# EAGLE design dcmctrl-hb-2-board_v1 (EAGLE 6.2)
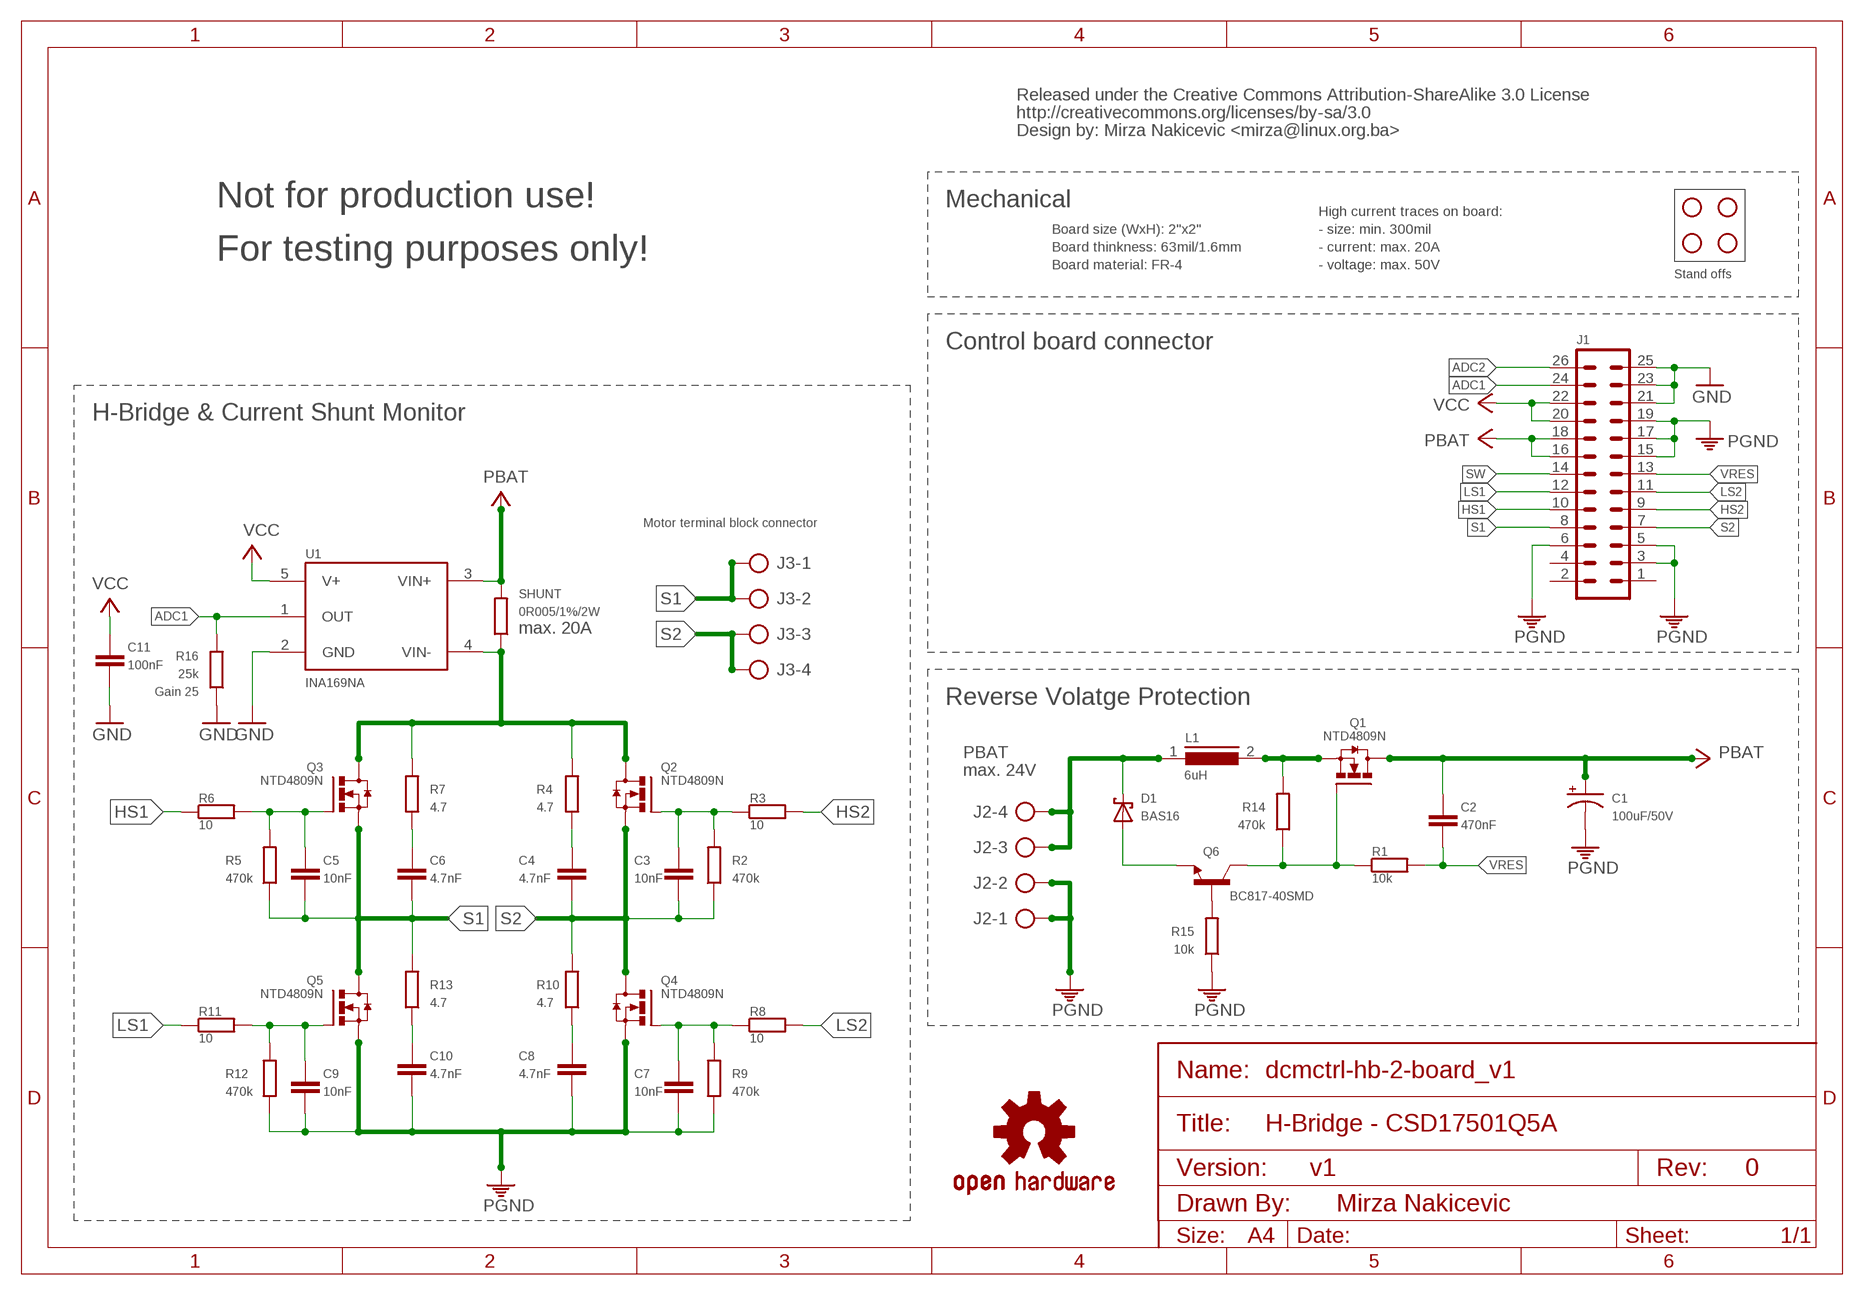
[diagram p0: schematic, sheet 1]

## Parts
C1  100uF/50V  CPOL-USE5-13  [E5-13]
C2  470nF  C-0603  [C0603]
C3  10nF  C-0603  [C0603]
C4  4.7nF  C-0603  [C0603]
C5  10nF  C-0603  [C0603]
C6  4.7nF  C-0603  [C0603]
C7  10nF  C-0603  [C0603]
C8  4.7nF  C-0603  [C0603]
C9  10nF  C-0603  [C0603]
C10  4.7nF  C-0603  [C0603]
C11  100nF  C-0603  [C0603]
D1  BAS16  BAS40  [SOT23]
J1  MA13-2  [MA13-2]
J2  W237-4  [W237-4]
J3  W237-4  [W237-4]
L1  6uH  DR127  [DR127]
Q1  NTD4809N  [DPAK]
Q2  NTD4809N  [DPAK]
Q3  NTD4809N  [DPAK]
Q4  NTD4809N  [DPAK]
Q5  NTD4809N  [DPAK]
Q6  BC817-40SMD  [SOT23-BEC]
R1  10k  R-0603  [R0603]
R2  470k  R-0603  [R0603]
R3  10  R-0603  [R0603]
R4  4.7  R-0603  [R0603]
R5  470k  R-0603  [R0603]
R6  10  R-0603  [R0603]
R7  4.7  R-0603  [R0603]
R8  10  R-0603  [R0603]
R9  470k  R-0603  [R0603]
R10  4.7  R-0603  [R0603]
R11  10  R-0603  [R0603]
R12  470k  R-0603  [R0603]
R13  4.7  R-0603  [R0603]
R14  470k  R-0603  [R0603]
R15  10k  R-0603  [R0603]
R16  25k  R-0603  [R0603]
SHUNT  0R005/1%/2W  R-2512  [R2512]
U1  INA169NA  [SOT23-5]
U$2  STAND-OFF  [STAND-OFF]
U$3  STAND-OFF  [STAND-OFF]
U$4  STAND-OFF  [STAND-OFF]
U$6  STAND-OFF  [STAND-OFF]
U$9  CC-SA  [CC-SA]
U$10  OSHW-LOGOM  [OSHW-LOGO-M]

## Nets
ADC1: J1.24 R16.2 U1.1(OUT)
ADC2: J1.26
GND: C11.2 J1.21 J1.23 J1.25 R16.1 U1.2(GND)
HS1: J1.10 R6.1
HS2: J1.9 R3.2
LS1: J1.12 R11.1
LS2: J1.11 R8.2
N$1: C5.1 Q3.1(G) R5.2 R6.2
N$2: Q6.B R15.2
N$3: C9.1 Q5.1(G) R11.2 R12.2
N$4: C7.1 Q4.1(G) R8.1 R9.2
N$5: C3.1 Q2.1(G) R2.2 R3.1
N$6: C6.1 R7.1
N$7: D1.1(A) Q6.E
N$8: C10.1 R13.1
N$9: Q1.1(G) Q6.C R1.1 R14.1
N$10: C8.1 R10.1
N$11: C4.1 R4.1
PBAT: C1.+ C2.1 J1.16 J1.18 Q1.4(D) SHUNT.2 U1.3(VIN+)
PBAT-: Q2.4(D) Q3.4(D) R4.2 R7.2 SHUNT.1 U1.4(VIN-)
PGND: C1.- C7.2 C8.2 C9.2 C10.2 J1.3 J1.5 J1.6 J1.15 J1.17 J1.19 J2.1 J2.2 Q4.3(S) Q5.3(S) R9.1 R12.1 R15.1
S1: C5.2 C6.2 J1.8 J3.1 J3.2 Q3.3(S) Q5.4(D) R5.1 R13.2
S2: C3.2 C4.2 J1.7 J3.3 J3.4 Q2.3(S) Q4.4(D) R2.1 R10.2
SW: J1.14
VCC: C11.1 J1.20 J1.22 U1.5(V+)
VIN: D1.3(C) J2.3 J2.4 L1.1
VIN2: L1.2 Q1.3(S) R14.2
VRES: C2.2 J1.13 R1.2
Unconnected: J1.1 J1.2 J1.4

## Notes on the sheet
- Not for production use! | Mechanical
- High current traces on board:
- Board size (WxH): 2"x2" | - size: min. 300mil
- Board thinkness: 63mil/1.6mm | - current: max. 20A
- For testing purposes only!
- Board material: FR-4 | - voltage: max. 50V
- Stand offs
- Control board connector
- H-Bridge & Current Shunt Monitor
- Motor terminal block connector
- max. 20A
- Gain 25
- Reverse Volatge Protection
- PBAT
- max. 24V
- H-Bridge - CSD17501Q5A
- v1 | 0
- Mirza Nakicevic
- A4

## Library data of the parts
C1 = rcl:CPOL-US: POLARIZED CAPACITOR, American symbol
C2-C11 = rlc:C: Capacitor Standard SMD ceramic and 0.1" leaded capacitors.
D1 = diode:BAS40: Silicon Schottky Diodes General-purpose diode for high-speed switching
J1 = con-pinhead:MA13-2: PIN HEADER; OC_FARNELL: unknown; OC_NEWARK: unknown
J2 J3 = con-wago-500:W237-4: WAGO SCREW CLAMP; OC_FARNELL: unknown; OC_NEWARK: unknown
L1 = inductors:DR127: High Power Density, High Efficiency, Shielded Inductors Source: coiltronics_dr_series.pdf
Q1-Q5 = transistor-fet:NTD4809N
Q6 = transistor-npn:BC817*: NPN Transistor
R1-R16 SHUNT = rlc:R: Resistor Basic schematic elements and footprints for 0603, 1206, and PTH 1/10th watt (small) resistors.
U1 = ic-opamp:INA169: High-Side Measurement CURRENT SHUNT MONITOR
U$2-U$4 U$6 = other:STAND-OFF: Stand Off This is the mechanical footprint for a #4 phillips button head screw. Use the keepout ring to avoid running the screw head into surrounding components.
U$9 = other:CC-SA
U$10 = other:OSHW-LOGO: Open Source Hardware Logo This logo indicates the piece of hardware it is found on incorporates a OSHW license and/or adheres to the definition of open source hardware found here: http://freedomdefined.org/OSHW

## Board
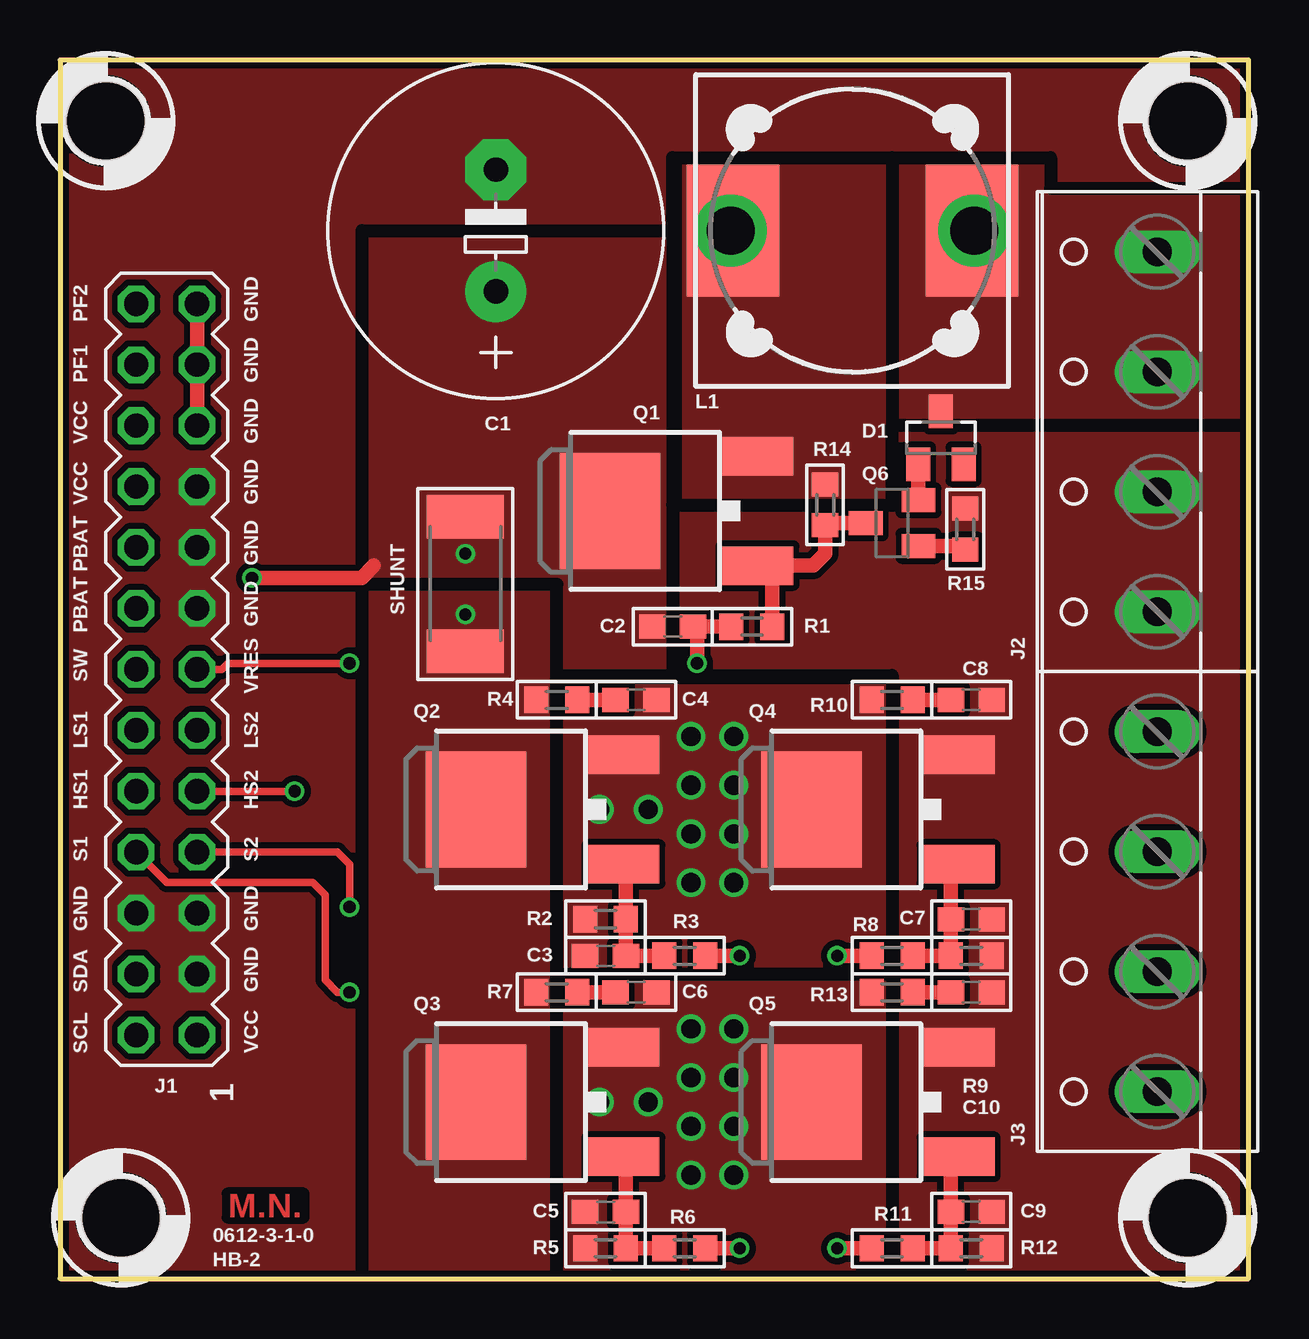
[diagram p1: board, top side]
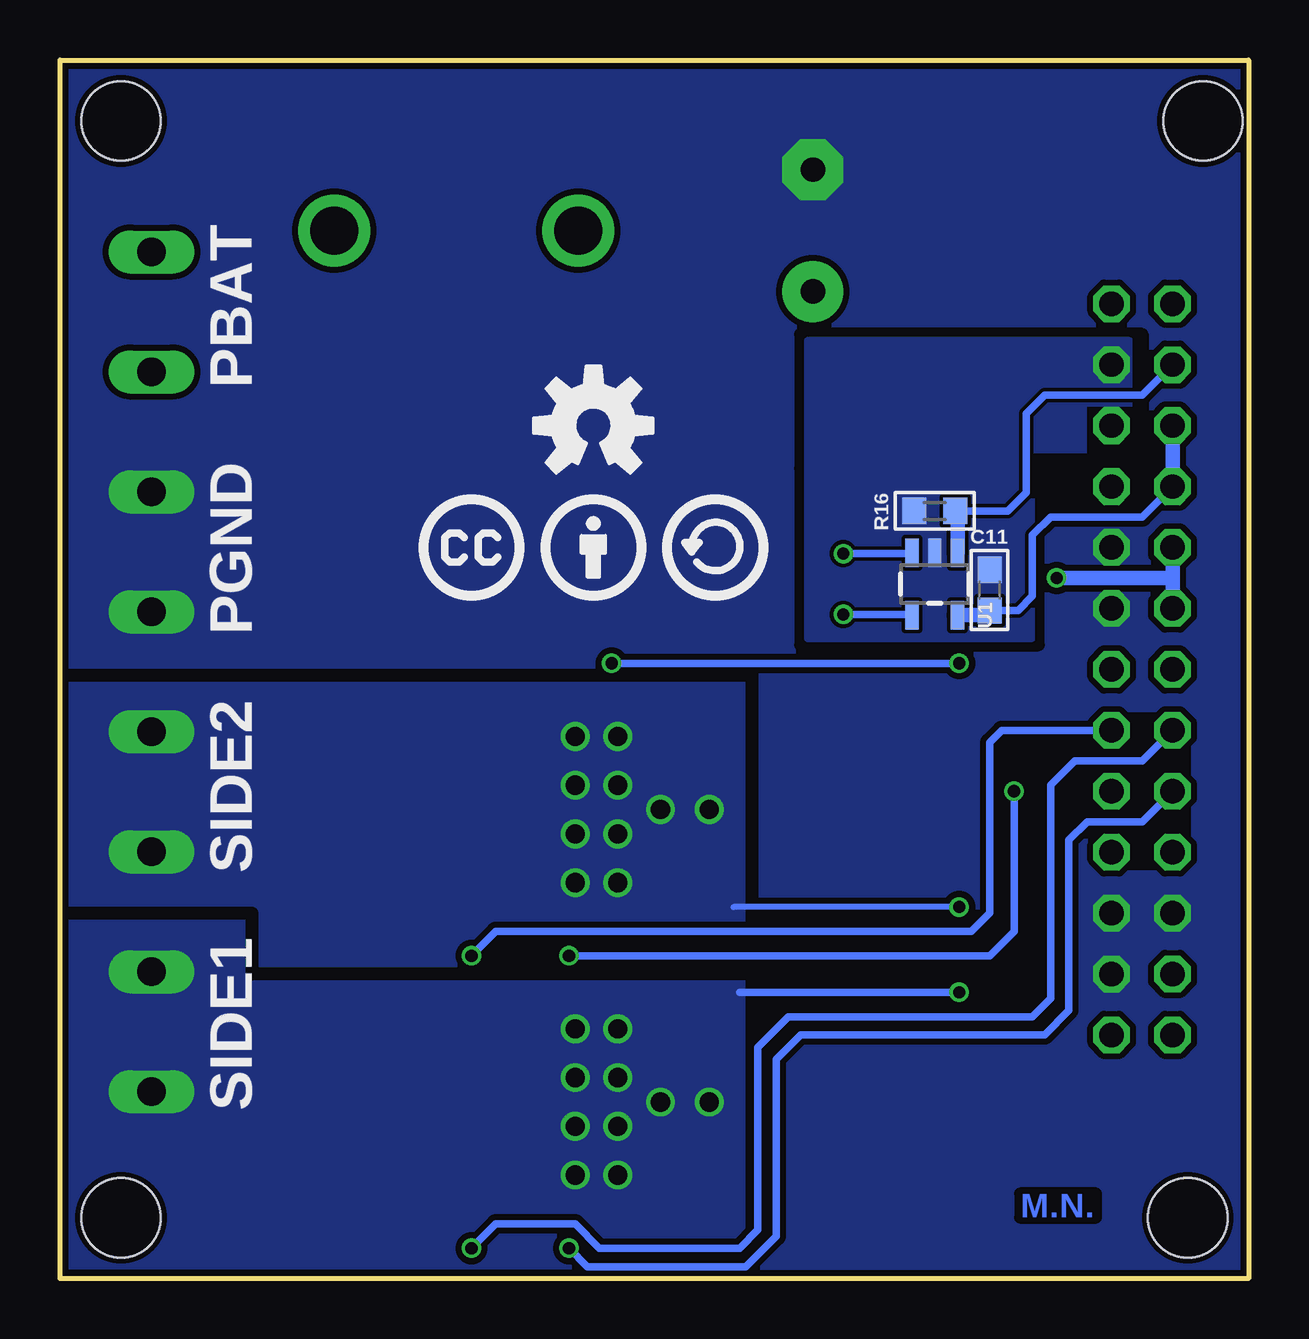
[diagram p2: board, bottom side, seen from below]

Size 49.53 x 50.8 mm. Coordinates in mm from the lower left corner, seen from the top.
Outline: 0,0 49.53,0 49.53,50.8 0,50.8 0,0
Copper layers (1*16): Top 0.035mm / dielectric 1.5mm / Bottom 0.035mm
Design rules: minimum track width 6mil, minimum drill 12mil, track to track 6mil, track to pad 6mil, pad to pad 6mil, via to via 6mil, smd to smd 0mil, copper to edge 10mil, drill to drill 10mil, minimum pad ring 10mil, minimum via ring 6mil, stop-mask expansion 2mil, vias tented up to drill 100mil, thermal gap 10mil
tRestrict: 27 lines
bRestrict: area 2.7,17.3 to 6.2,23.4; area 5,32.3 to 6.5,33.8; area 5,34.5 to 6.7,36.3; 17 lines

### Footprints (pad centres in the part's own frame; a part is rotated, then mirrored left to right if it is on the bottom)
E5-13 = drill 1.016 pad 2.54: + -2.54,0 | drill 1.016 pad 2.54 octagon: - 2.54,0
C0603 = smd 1.1 x 1: 1 -0.85,0; 2 0.85,0
SOT23 = smd 1 x 1.4: 1 -0.95,-1.1; 2 0.95,-1.1; 3 0,1.1
MA13-2 = drill 1.016 octagon: 1 -15.24,-1.27; 2 -15.24,1.27; 3 -12.7,-1.27; 4 -12.7,1.27; 5 -10.16,-1.27; 6 -10.16,1.27; 7 -7.62,-1.27; 8 -7.62,1.27; 9 -5.08,-1.27; 10 -5.08,1.27; 11 -2.54,-1.27; 12 -2.54,1.27; 13 0,-1.27; 14 0,1.27; 15 2.54,-1.27; 16 2.54,1.27; 17 5.08,-1.27; 18 5.08,1.27; 19 7.62,-1.27; 20 7.62,1.27; 21 10.16,-1.27; 22 10.16,1.27; 23 12.7,-1.27; 24 12.7,1.27; 25 15.24,-1.27; 26 15.24,1.27
W237-4 = drill 1.194 long: 1 -7.5,-1.27; 2 -2.5,-1.27; 3 2.5,-1.27; 4 7.5,-1.27
DR127 = smd 3.85 x 5.5: 1 -4.975,0; 2 4.975,0
DPAK = smd 1.6 x 3: 1 -2.28,-4.04; 3 2.28,-4.04 | smd 4.826 x 4.191: 4 0,2.096
SOT23-BEC = smd 1 x 1.4: B -0.95,-1.1; C 0,1.1; E 0.95,-1.1
R0603 = smd 1 x 1.1: 1 -0.85,0; 2 0.85,0
R2512 = smd 1.8 x 3.2: 1 -2.8,0; 2 2.8,0
SOT23-5 = smd 0.55 x 1.2: 1 -0.95,-1.3; 2 0,-1.3; 3 0.95,-1.3; 4 0.95,1.3; 5 -0.95,1.3
STAND-OFF = hole 3.302: 0,0

### Placement (x,y rotation side)
C1  18.16,43.69 90 top
C2  25.53,27.18 0 top
C3  22.73,13.46 180 top
C4  24,24.13 0 top
C5  22.73,2.79 180 top
C6  24,11.94 0 top
C7  37.97,14.99 0 top
C8  37.97,24.13 0 top
C9  37.97,2.79 0 top
C10  37.97,11.94 0 top
C11  10.79,28.7 90 bottom
D1  36.7,35.05 0 top
J1  4.45,25.4 90 top
J2  44.45,35.3 90 top
J3  44.45,15.3 90 top
L1  33.02,43.69 180 top
Q1  25.02,32 90 top
Q2  19.43,19.56 90 top
Q3  19.43,7.37 90 top
Q4  33.4,19.56 90 top
Q5  33.4,7.37 90 top
Q6  34.67,31.5 90 top
R1  28.83,27.18 180 top
R2  22.73,14.99 0 top
R3  26.04,13.46 0 top
R4  20.7,24.13 180 top
R5  22.73,1.27 0 top
R6  26.04,1.27 180 top
R7  20.7,11.94 180 top
R8  34.67,13.46 180 top
R9  37.97,13.46 180 top
R10  34.67,24.13 180 top
R11  34.67,1.27 0 top
R12  37.97,1.27 180 top
R13  34.67,11.94 180 top
R14  31.88,32.26 90 top
R15  37.72,31.24 270 top
R16  13.08,32 0 bottom
SHUNT  16.89,28.96 90 top
U1  13.08,28.96 180 bottom
U$2  1.91,48.26 0 top
U$3  46.99,2.54 0 top
U$4  2.54,2.54 0 top
U$6  46.99,48.26 0 top
U$9  27.3,30.48 0 bottom
U$10  27.3,35.56 0 bottom

### Tracks (layer width: path | path; a pad name or v marks a point on that pad's centre or on a via)
ADC1
  Bottom 0.305: J1.24 4.45,36.83 8.51,36.83 9.27,36.07 9.27,32.77 10.03,32 R16.2 12.13,31.9
  Bottom 0.61: U1.1 12.13,31.9
GND
  Top 0.61: J1.25 J1.23 J1.21
  pour Bottom (no thermals): 4.95,39.12 18.41,39.12 18.41,26.67 9.02,26.67 9.02,34.54 4.95,34.54
HS1  (via drill 0.51)
  Top 0.61: R6.1 v28.32,1.27
  Bottom 0.305: J1.10 4.45,19.05 6.73,19.05 7.49,18.29 7.49,11.18 8.51,10.16 18.67,10.16 19.68,9.14 19.68,1.78 20.95,0.51 27.56,0.51 v28.32,1.27
HS2  (via drill 0.51)
  Top 0.305: J1.9 7.24,20.32 8,20.32 v9.78,20.32
  Top 0.61: R3.2 v28.32,13.46
  Bottom 0.305: v9.78,20.32 9.78,14.48 10.79,13.46 v28.32,13.46
LS1  (via drill 0.51)
  Top 0.61: v32.38,1.27 R11.1
  Bottom 0.305: J1.12 4.45,21.59 7.24,21.59 8.26,20.57 8.26,11.68 9.02,10.92 19.18,10.92 20.45,9.65 20.45,2.03 21.21,1.27 27.05,1.27 28.07,2.29 31.37,2.29 v32.38,1.27
LS2  (via drill 0.51)
  Top 0.61: v32.38,13.46 R8.2
  Bottom 0.305: v32.38,13.46 31.37,14.48 11.56,14.48 10.79,15.24 10.79,22.35 10.29,22.86 J1.11
N$1
  Top 0.305: 23.58,4.97 Q3.1
  Top 0.61: R6.2 R5.2 C5.1 23.58,4.97
N$2
  Top 0.305: 37.69,30.55 R15.2
  Top 0.61: Q6.B 37.69,30.55
N$3
  Top 0.305: 37.12,4.77 Q5.1
  Top 0.61: R11.2 R12.2 C9.1 37.12,4.77
N$4
  Top 0.305: 37.12,16.96 Q4.1
  Top 0.61: R8.1 R9.2 C7.1 37.12,16.96
N$5
  Top 0.305: 23.58,17.17 Q2.1
  Top 0.61: R3.1 C3.1 R2.2 23.58,17.17
N$6
  Top 0.61: R7.1 C6.1
N$7
  Top 0.305: 35.75,32.46 Q6.E
  Top 0.61: D1.1 35.75,32.46
N$8
  Top 0.61: R13.1 C10.1
N$9
  Top 0.305: Q1.1 29.59,29.72 29.68,29.64 | 31.96,31.5 R14.1
  Top 0.61: 29.59,29.72 31.38,29.72 31.88,30.23 R14.1 | Q6.C 31.96,31.5 | R1.1 29.68,29.64
N$10
  Top 0.61: R10.1 C8.1
N$11
  Top 0.61: R4.1 C4.1
PBAT  (via drill 0.51)
  Top 0.61: v8,29.21 12.57,29.21 13.08,29.72
  Bottom 0.305: v16.89,30.23 14.06,30.23 U1.3
  Bottom 0.61: J1.16 3.17,29.21 | 3.17,29.21 J1.18 | v8,29.21 3.17,29.21
  pour Top (isolate 0.254, no thermals): 12.83,29.21 20.95,29.21 20.95,25.4 25.27,25.4 25.27,43.43 12.83,43.43
PBAT-  (via drill 0.51)
  Bottom 0.305: v16.89,27.69 14.06,27.69 U1.4
  pour Top (isolate 0.254, no thermals): 12.83,0.25 20.45,0.25 20.45,28.7 12.83,28.7
PGND
  pour Top (isolate 0.254, no thermals): 0,0 49.53,0 49.53,50.8 0,50.8
  pour Bottom (isolate 0.254, no thermals): 0,0 49.53,0 49.53,50.8 0,50.8
S1  (via drill 0.51, 0.8)
  Top 0.305: J1.8 4.45,16.51 10.54,16.51 11.05,16 11.05,12.45 11.56,11.94 v12.06,11.94
  Bottom 0.305: v12.06,11.94 21.21,11.94
  other vias: 28.07,10.41 26.29,10.41 26.29,4.32 28.07,4.32 26.29,8.38 28.07,8.38 26.29,6.35 28.07,6.35 24.51,7.37 22.48,7.37
  pour Top (isolate 0.254, no thermals): 20.95,12.45 34.42,12.45 34.42,0.25 20.95,0.25
  pour Bottom (isolate 0.254, no thermals): 20.95,0.51 49.28,0.51 49.28,14.99 41.78,14.99 41.78,12.45 20.95,12.45
S2  (via drill 0.51, 0.8)
  Top 0.305: J1.7 11.56,17.78 12.06,17.27 v12.06,15.49
  Bottom 0.254: v12.06,15.49 21.46,15.49
  other vias: 28.07,20.57 28.07,22.61 26.29,18.54 26.29,20.57 26.29,22.61 26.29,16.51 28.07,18.54 28.07,16.51 24.51,19.56 22.48,19.56
  pour Top (isolate 0.254, no thermals): 20.95,12.95 34.42,12.95 34.42,24.64 20.95,24.64
  pour Bottom (isolate 0.254, no thermals): 20.95,11.68 41.27,11.68 41.27,15.49 49.28,15.49 49.28,24.89 20.95,24.89
VCC
  Bottom 0.305: J1.20 4.45,31.75 6.48,31.75 8.26,31.75 9.02,30.99 9.02,28.45 9.61,27.85 C11.1 10.99,27.66
  Bottom 0.61: U1.5 10.99,27.66 | J1.20 J1.22
VIN  (via drill 2)
  other vias: 38.1,43.69
  pour Top (isolate 0.254, no thermals): 34.92,46.48 49.28,46.48 49.28,35.81 34.92,35.81
VIN2  (via drill 2)
  other vias: 27.94,43.69
  pour Top (isolate 0.254, no thermals): 26.04,32.51 34.42,32.51 34.42,46.48 26.04,46.48
VRES  (via drill 0.51)
  Top 0.305: 26.54,27.27 C2.2 | J1.13 6.73,25.4 6.99,25.65 v12.06,25.65
  Top 0.61: R1.2 C2.2 | v26.54,25.65 26.54,27.27
  Bottom 0.305: v12.06,25.65 v26.54,25.65

### Text on the board
Top: M.N.
Bottom: M.N.
tPlace: PF2 | GND | PF1 | GND | VCC | GND | VCC | GND | GND | PBAT | PBAT | GND | SW | VRES | LS1 | LS2 | HS1 | HS2 | S1 | S2 | GND | GND | SDA | GND | SCL | VCC | 1 | 0612-3-1-0 | HB-2
bPlace: PBAT | PGND | SIDE2 | SIDE1